# EAGLE design MicrocontrollerBoard_V0.2 (EAGLE 6.4)
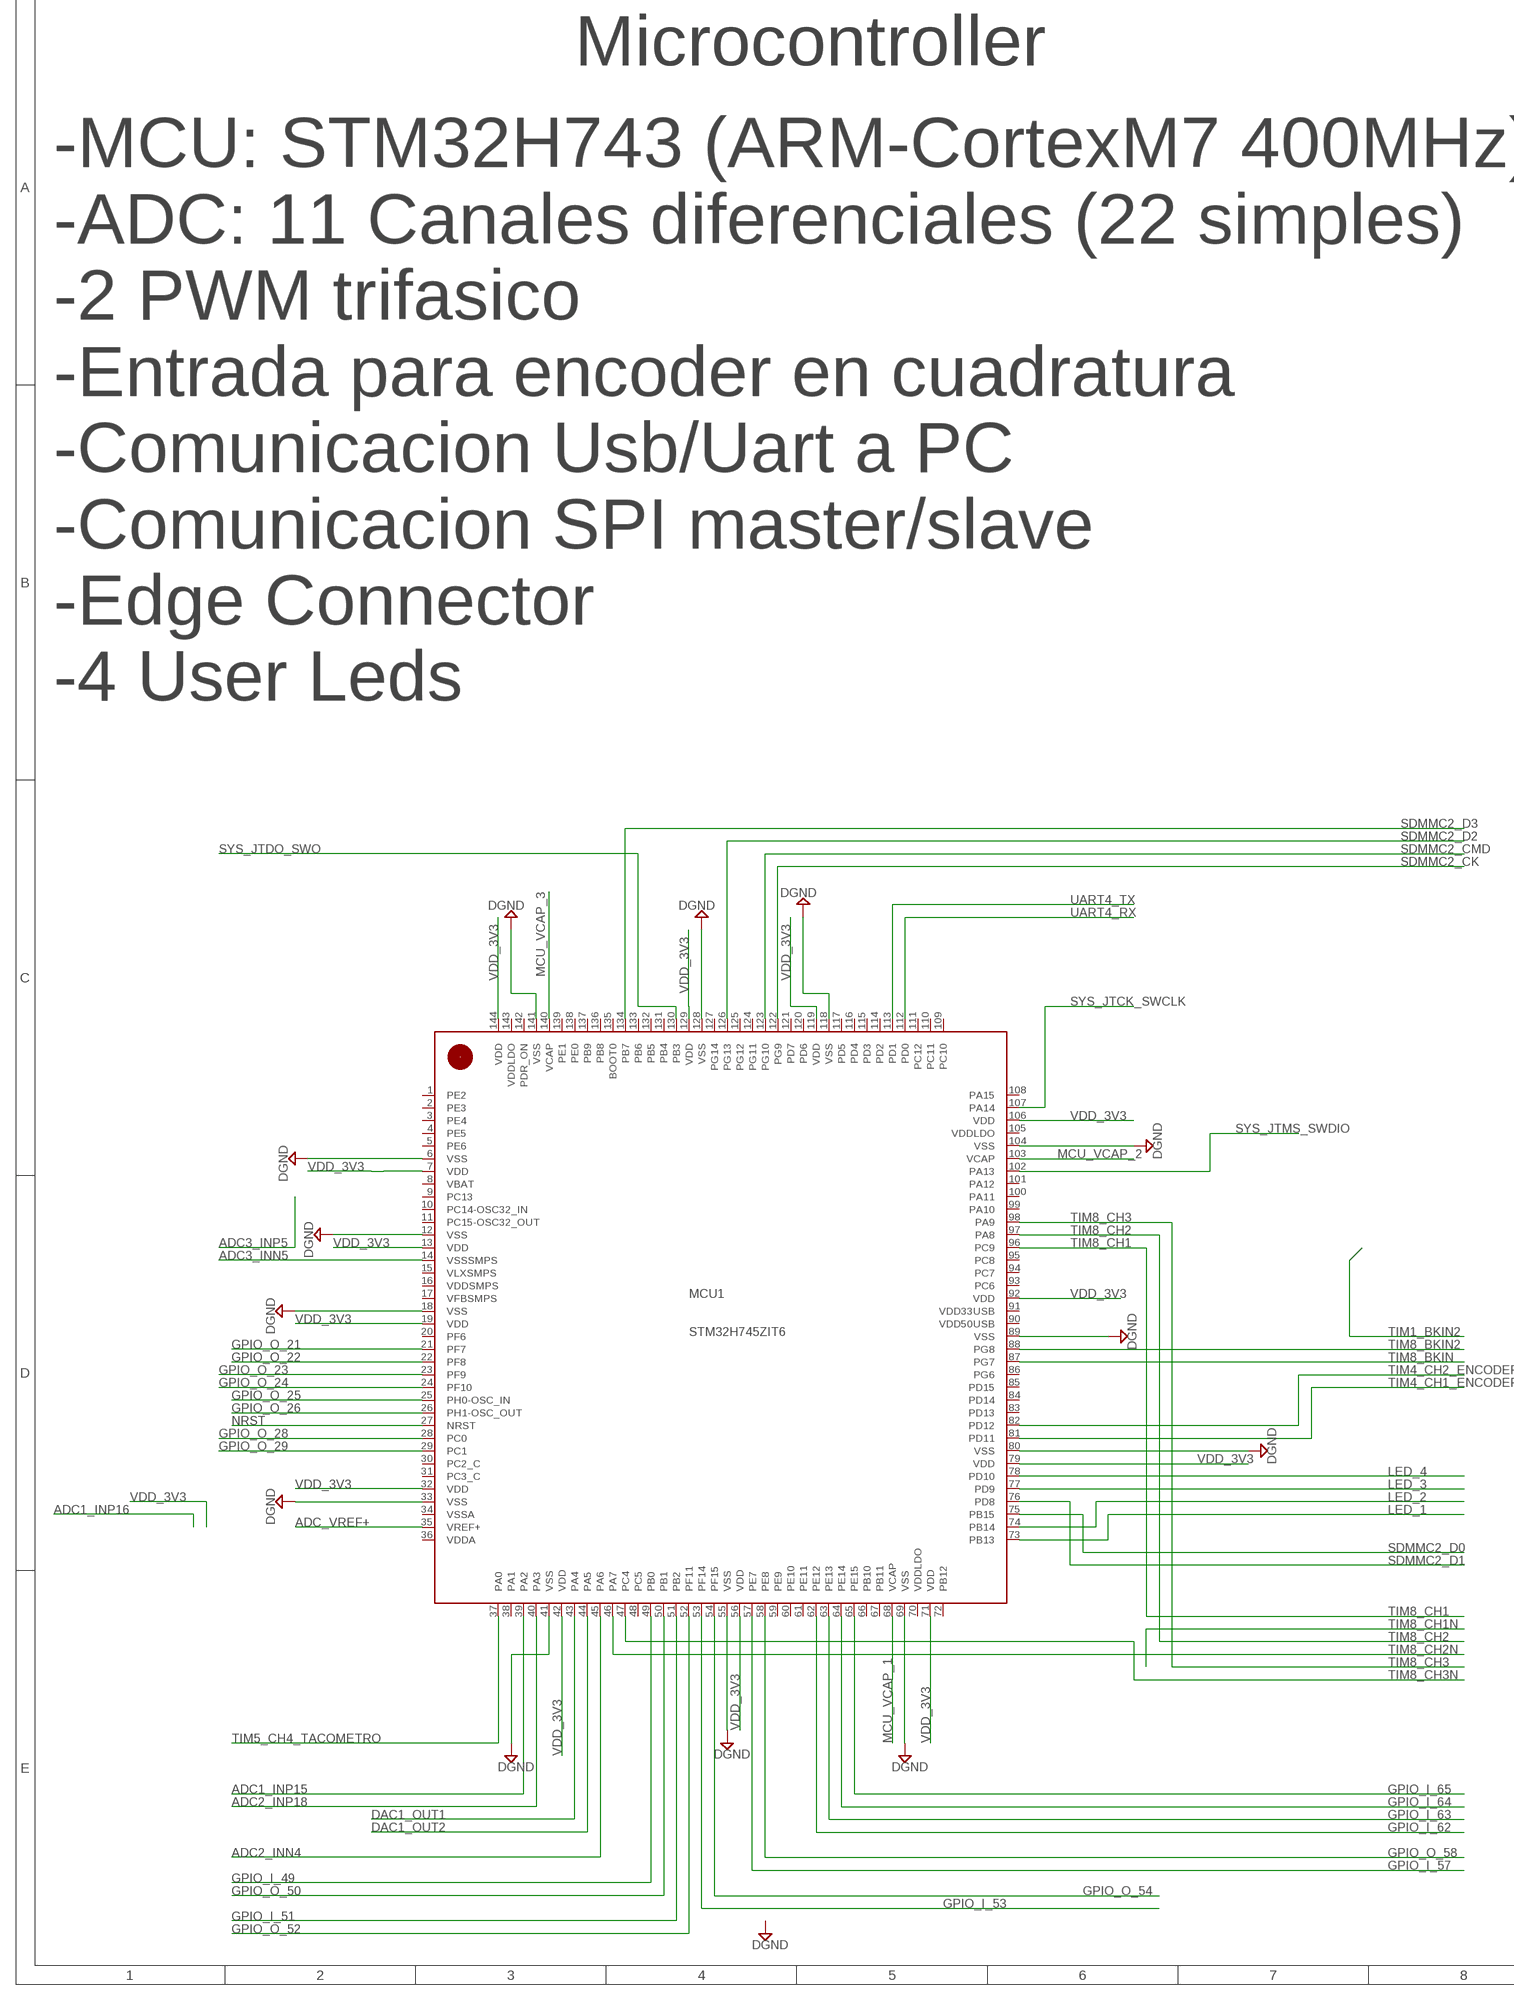
[diagram p0: schematic, sheet 1, part 1 of 2]
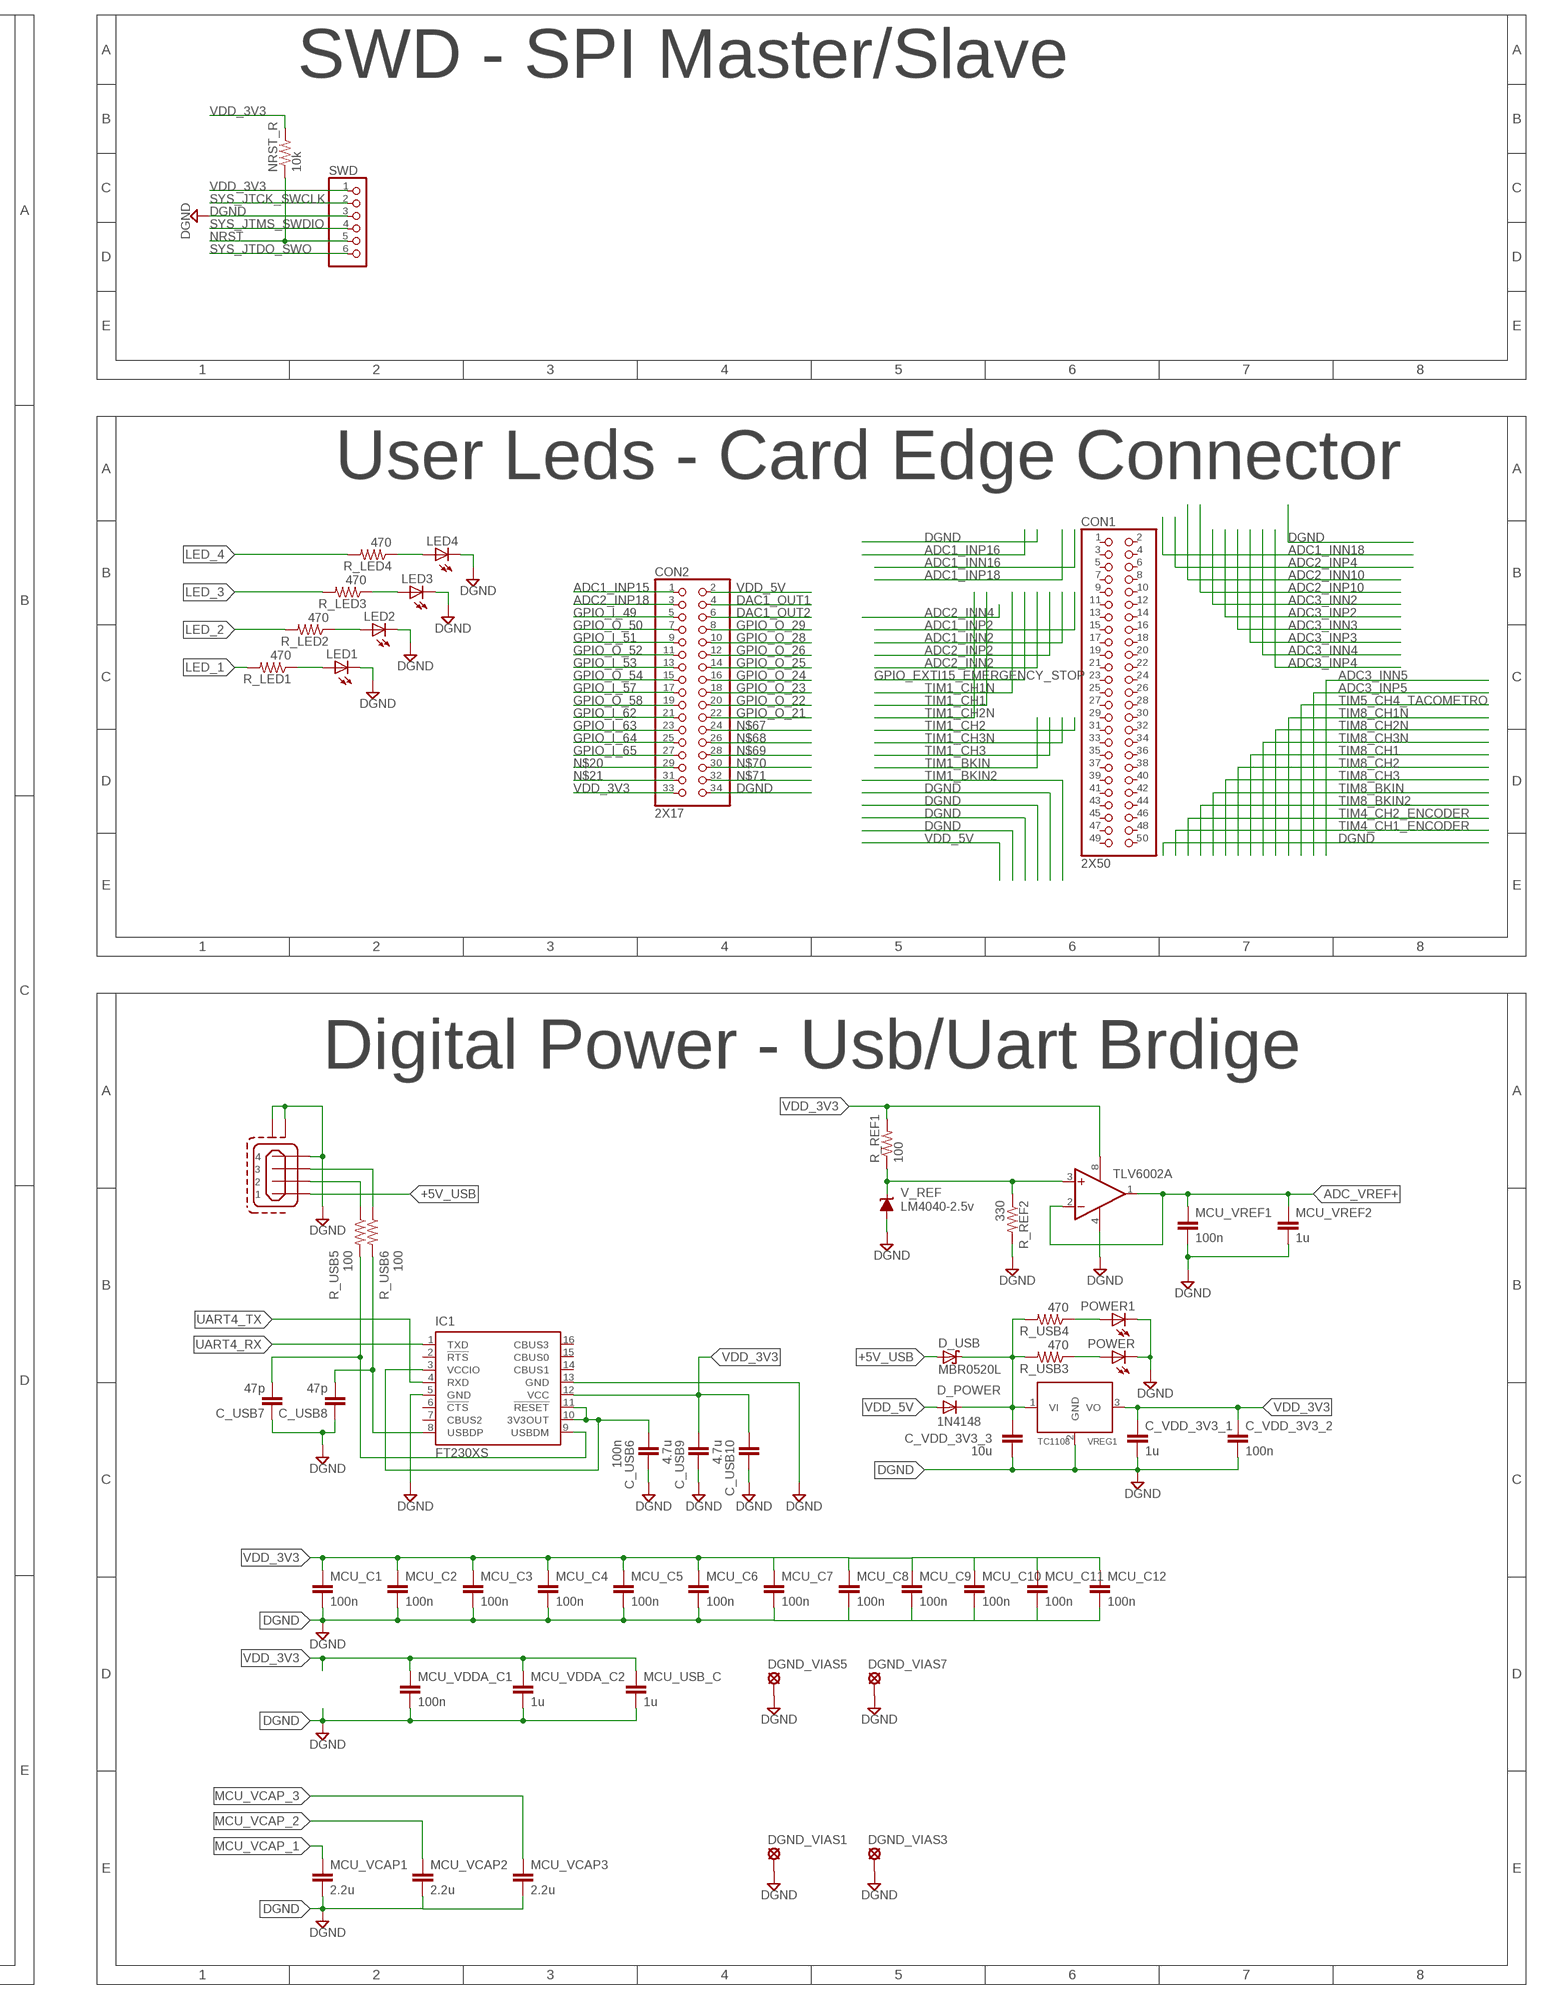
[diagram p1: schematic, sheet 1, part 2 of 2]

## Parts
C_USB6  100n  C-EUC0402  [C0402]
C_USB7  47p  C-EUC0402  [C0402]
C_USB8  47p  C-EUC0402  [C0402]
C_USB9  4.7u  C-EUC0402  [C0402]
C_USB10  4.7u  C-EUC0402  [C0402]
C_VDD_3V3_1  1u  C-EUC0603K  [C0603K]
C_VDD_3V3_2  100n  C-EUC0603K  [C0603K]
C_VDD_3V3_3  10u  C-EUC0603K  [C0603K]
CON1  2X50  [2X25]
CON2  2X17  [2X17]
D_POWER  1N4148  GF1  [SMA-DO214AC]
D_USB  MBR0520L  [SOD-123]
DGND_VIAS1  LSP10  [LSP10]
DGND_VIAS3  LSP10  [LSP10]
DGND_VIAS5  LSP10  [LSP10]
DGND_VIAS7  LSP10  [LSP10]
IC1  FT230XS  [SSOP16]
LED1  LEDCHIPLED_0805  [CHIPLED_0805]
LED2  LEDCHIPLED_0805  [CHIPLED_0805]
LED3  LEDCHIPLED_0805  [CHIPLED_0805]
LED4  LEDCHIPLED_0805  [CHIPLED_0805]
MCU1  STM32H745ZIT6144  [LQFP144]
MCU_C1  100n  C-EUC0402  [C0402]
MCU_C2  100n  C-EUC0402  [C0402]
MCU_C3  100n  C-EUC0402  [C0402]
MCU_C4  100n  C-EUC0402  [C0402]
MCU_C5  100n  C-EUC0402  [C0402]
MCU_C6  100n  C-EUC0402  [C0402]
MCU_C7  100n  C-EUC0402  [C0402]
MCU_C8  100n  C-EUC0402  [C0402]
MCU_C9  100n  C-EUC0402  [C0402]
MCU_C10  100n  C-EUC0402  [C0402]
MCU_C11  100n  C-EUC0402  [C0402]
MCU_C12  100n  C-EUC0402  [C0402]
MCU_USB_C  1u  C-EUC0402  [C0402]
MCU_VCAP1  2.2u  C-EUC0402  [C0402]
MCU_VCAP2  2.2u  C-EUC0402  [C0402]
MCU_VCAP3  2.2u  C-EUC0402  [C0402]
MCU_VDDA_C1  100n  C-EUC0402  [C0402]
MCU_VDDA_C2  1u  C-EUC0402  [C0402]
MCU_VREF1  100n  C-EUC0402  [C0402]
MCU_VREF2  1u  C-EUC0402  [C0402]
NRST_R  10k  R-US_R0402  [R0402]
POWER  LEDCHIPLED_0805  [CHIPLED_0805]
POWER1  LEDCHIPLED_0805  [CHIPLED_0805]
R_LED1  470  R-US_R0402  [R0402]
R_LED2  470  R-US_R0402  [R0402]
R_LED3  470  R-US_R0402  [R0402]
R_LED4  470  R-US_R0402  [R0402]
R_REF1  100  R-US_R0805  [R0805]
R_REF2  330  R-US_R0805  [R0805]
R_USB3  470  R-US_R0402  [R0402]
R_USB4  470  R-US_R0402  [R0402]
R_USB5  100  R-US_R0402  [R0402]
R_USB6  100  R-US_R0402  [R0402]
SWD  PINHD-1X6/90  [1X06/90]
TLV6002  TL082D  [SO08]
V_REF  LM4040-2.5v  LM4041A12DBZ  [DBZ_R-PDSO-G3]
VREG1  TC1108'SOT-223'  [SOT-223]
X2  MINI-USB_SHIELD4P-85-32004-00X  [85-32004-00X]

## Nets
+5V_USB: D_USB.A(IN) X2.1
ADC1_INP15: CON2.1 MCU1.39(PA2)
ADC2_INN4: MCU1.45(PA6)
ADC2_INP18: CON2.3 MCU1.40(PA3)
ADC3_INN5: MCU1.14(VSSSMPS)
ADC_VREF+: MCU1.35(VREF+) MCU_VREF1.1 MCU_VREF2.1 TLV6002.1(A:OUT) TLV6002.2(A:-IN)
DAC1_OUT1: CON2.4 MCU1.43(PA4)
DAC1_OUT2: CON2.6 MCU1.44(PA5)
DGND: C_USB6.1 C_USB7.1 C_USB8.1 C_USB9.1 C_USB10.1 C_VDD_3V3_1.2 C_VDD_3V3_2.2 C_VDD_3V3_3.2 CON2.34 DGND_VIAS1.MP DGND_VIAS3.MP DGND_VIAS5.MP DGND_VIAS7.MP IC1.5(GND) IC1.13(GND) LED1.C LED2.C LED3.C LED4.C MCU1.6(VSS) MCU1.12(VSS) MCU1.18(VSS) MCU1.33(VSS) MCU1.41(VSS) MCU1.55(VSS) MCU1.69(VSS) MCU1.80(VSS) MCU1.89(VSS) MCU1.104(VSS) MCU1.118(VSS) MCU1.128(VSS) MCU1.141(VSS) MCU_C1.2 MCU_C2.2 MCU_C3.2 MCU_C4.2 MCU_C5.2 MCU_C6.2 MCU_C7.2 MCU_C8.2 MCU_C9.2 MCU_C10.2 MCU_C11.2 MCU_C12.2 MCU_USB_C.2 MCU_VCAP1.2 MCU_VCAP2.2 MCU_VCAP3.2 MCU_VDDA_C1.2 MCU_VDDA_C2.2 MCU_VREF1.2 MCU_VREF2.2 POWER1.C POWER.C R_REF2.2 SWD.3 TLV6002.4(P:V-) V_REF.2(A) VREG1.2(GND) X2.4 X2.M1(S1) X2.M2(S2)
GPIO_I_49: CON2.5 MCU1.49(PB0)
GPIO_I_51: CON2.9 MCU1.51(PB2)
GPIO_I_53: CON2.13 MCU1.53(PF14)
GPIO_I_57: CON2.17 MCU1.57(PE7)
GPIO_I_62: CON2.21 MCU1.62(PE12)
GPIO_I_63: CON2.23 MCU1.63(PE13)
GPIO_I_64: CON2.25 MCU1.64(PE14)
GPIO_I_65: CON2.27 MCU1.65(PE15)
GPIO_O_21: CON2.22 MCU1.21(PF7)
GPIO_O_22: CON2.20 MCU1.22(PF8)
GPIO_O_23: CON2.18 MCU1.23(PF9)
GPIO_O_24: CON2.16 MCU1.24(PF10)
GPIO_O_25: CON2.14 MCU1.25(PH0-OSC_IN)
GPIO_O_26: CON2.12 MCU1.26(PH1-OSC_OUT)
GPIO_O_28: CON2.10 MCU1.28(PC0)
GPIO_O_29: CON2.8 MCU1.29(PC1)
GPIO_O_50: CON2.7 MCU1.50(PB1)
GPIO_O_52: CON2.11 MCU1.52(PF11)
GPIO_O_54: CON2.15 MCU1.54(PF15)
GPIO_O_58: CON2.19 MCU1.58(PE8)
LED_1: MCU1.73(PB13) R_LED1.2
LED_2: MCU1.74(PB14) R_LED2.2
LED_3: MCU1.77(PD9) R_LED3.2
LED_4: MCU1.78(PD10) R_LED4.2
MCU_VCAP_1: MCU1.68(VCAP) MCU_VCAP1.1
MCU_VCAP_2: MCU1.103(VCAP) MCU_VCAP2.1
MCU_VCAP_3: MCU1.140(VCAP) MCU_VCAP3.1
N$2: LED4.A R_LED4.1
N$7: POWER1.A R_USB4.1
N$11: LED3.A R_LED3.1
N$12: C_USB6.2 IC1.3(VCCIO) IC1.10(3V3OUT) IC1.11(!RESET)
N$15: C_VDD_3V3_3.1 D_POWER.K(C) D_USB.C(OUT) R_USB3.2 R_USB4.2 VREG1.1(VI)
N$16: C_USB8.2 IC1.8(USBDP) R_USB6.2
N$17: C_USB7.2 IC1.9(USBDM) R_USB5.2
N$20: CON2.29
N$21: CON2.31
N$67: CON2.24
N$68: CON2.26
N$69: CON2.28
N$70: CON2.30
N$71: CON2.32
N$133: R_USB5.1 X2.2
N$134: R_USB6.1 X2.3
N$138: POWER.A R_USB3.1
N$144: R_REF1.1 R_REF2.1 TLV6002.3(A:+IN) V_REF.1(C)
N$147: LED1.A R_LED1.1
N$154: LED2.A R_LED2.1
NRST: MCU1.27(NRST) NRST_R.1 SWD.5
SDMMC2_CK: MCU1.122(PG9)
SDMMC2_CMD: MCU1.123(PG10)
SDMMC2_D0: MCU1.75(PB15)
SDMMC2_D1: MCU1.76(PD8)
SDMMC2_D2: MCU1.126(PG13)
SDMMC2_D3: MCU1.134(PB7)
SYS_JTCK_SWCLK: MCU1.107(PA14) SWD.2
SYS_JTDO_SWO: MCU1.130(PB3) SWD.6
SYS_JTMS_SWDIO: MCU1.102(PA13) SWD.4
TIM4_CH1_ENCODER: MCU1.81(PD11)
TIM4_CH2_ENCODER: MCU1.82(PD12)
TIM5_CH4_TACOMETRO: MCU1.37(PA0)
TIM8_BKIN: MCU1.87(PG7)
TIM8_BKIN2: MCU1.88(PG8)
TIM8_CH1: MCU1.96(PC9)
TIM8_CH2: MCU1.97(PA8)
TIM8_CH2N: MCU1.46(PA7)
TIM8_CH3: MCU1.98(PA9)
TIM8_CH3N: MCU1.47(PC4)
UART4_RX: IC1.1(TXD) MCU1.112(PD0)
UART4_TX: IC1.4(RXD) MCU1.113(PD1)
VDD_3V3: C_USB9.2 C_USB10.2 C_VDD_3V3_1.1 C_VDD_3V3_2.1 CON2.33 IC1.12(VCC) MCU1.7(VDD) MCU1.13(VDD) MCU1.19(VDD) MCU1.32(VDD) MCU1.42(VDD) MCU1.56(VDD) MCU1.71(VDD) MCU1.79(VDD) MCU1.92(VDD) MCU1.106(VDD) MCU1.119(VDD) MCU1.129(VDD) MCU1.144(VDD) MCU_C1.1 MCU_C2.1 MCU_C3.1 MCU_C4.1 MCU_C5.1 MCU_C6.1 MCU_C7.1 MCU_C8.1 MCU_C9.1 MCU_C10.1 MCU_C11.1 MCU_C12.1 MCU_USB_C.1 MCU_VDDA_C1.1 MCU_VDDA_C2.1 NRST_R.2 R_REF1.2 SWD.1 TLV6002.8(P:V+) VREG1.3(VO)
VDD_5V: CON2.2 D_POWER.A
Unconnected: CON1.1 CON1.2 CON1.3 CON1.4 CON1.5 CON1.6 CON1.7 CON1.8 CON1.9 CON1.10 CON1.11 CON1.12 CON1.13 CON1.14 CON1.15 CON1.16 CON1.17 CON1.18 CON1.19 CON1.20 CON1.21 CON1.22 CON1.23 CON1.24 CON1.25 CON1.26 CON1.27 CON1.28 CON1.29 CON1.30 CON1.31 CON1.32 CON1.33 CON1.34 CON1.35 CON1.36 CON1.37 CON1.38 CON1.39 CON1.40 CON1.41 CON1.42 CON1.43 CON1.44 CON1.45 CON1.46 CON1.47 CON1.48 CON1.49 CON1.50 IC1.2(!RTS) IC1.6(!CTS) IC1.7(CBUS2) IC1.14(CBUS1) IC1.15(CBUS0) IC1.16(CBUS3) MCU1.1(PE2) MCU1.2(PE3) MCU1.3(PE4) MCU1.4(PE5) MCU1.5(PE6) MCU1.8(VBAT) MCU1.9(PC13) MCU1.10(PC14-OSC32_IN) MCU1.11(PC15-OSC32_OUT) MCU1.15(VLXSMPS) MCU1.16(VDDSMPS) MCU1.17(VFBSMPS) MCU1.20(PF6) MCU1.30(PC2_C) MCU1.31(PC3_C) MCU1.34(VSSA) MCU1.36(VDDA) MCU1.38(PA1) MCU1.48(PC5) MCU1.59(PE9) MCU1.60(PE10) MCU1.61(PE11) MCU1.66(PB10) MCU1.67(PB11) MCU1.70(VDDLDO) MCU1.72(PB12) MCU1.83(PD13) MCU1.84(PD14) MCU1.85(PD15) MCU1.86(PG6) MCU1.90(VDD50USB) MCU1.91(VDD33USB) MCU1.93(PC6) MCU1.94(PC7) MCU1.95(PC8) MCU1.99(PA10) MCU1.100(PA11) MCU1.101(PA12) MCU1.105(VDDLDO) MCU1.108(PA15) MCU1.109(PC10) MCU1.110(PC11) MCU1.111(PC12) MCU1.114(PD2) MCU1.115(PD3) MCU1.116(PD4) MCU1.117(PD5) MCU1.120(PD6) MCU1.121(PD7) MCU1.124(PG11) MCU1.125(PG12) MCU1.127(PG14) MCU1.131(PB4) MCU1.132(PB5) MCU1.133(PB6) MCU1.135(BOOT0) MCU1.136(PB8) MCU1.137(PB9) MCU1.138(PE0) MCU1.139(PE1) MCU1.142(PDR_ON) MCU1.143(VDDLDO) TLV6002.5(B:+IN) TLV6002.6(B:-IN) TLV6002.7(B:OUT)

## Notes on the sheet
- Microcontroller | SWD - SPI Master/Slave
- User Leds - Card Edge Connector
- -MCU: STM32H743 (ARM-CortexM7 400MHz)
  -ADC: 11 Canales diferenciales (22 simples)
  -2 PWM trifasico
  -Entrada para encoder en cuadratura
  -Comunicacion Usb/Uart a PC
  -Comunicacion SPI master/slave
  -Edge Connector
  -4 User Leds
- Digital Power - Usb/Uart Brdige

## Library data of the parts
C_USB6-C_USB10 C_VDD_3V3_1-C_VDD_3V3_3 MCU_C1-MCU_C12 MCU_USB_C MCU_VCAP1-MCU_VCAP3 MCU_VDDA_C1 MCU_VDDA_C2 MCU_VREF1 MCU_VREF2 = rcl:C-EU: CAPACITOR, European symbol
CON1 = CardEdgePads:2X50
CON2 = CardEdgePads:2X17
D_POWER = diode:GF1: DIODE
D_USB = MBR:MBR0520L: The MBR0520L is a Schottky Rectifier whit Low Forward Voltage.
DGND_VIAS1 DGND_VIAS3 DGND_VIAS5 DGND_VIAS7 = solpad:LSP10: SOLDER PAD drill 1.0 mm, distributor Buerklin, 12H555
IC1 = ftdichip:FT230X: USB to BASIC UART IC Auto generated by make-symbol-device-package-bsdl.ulp Rev. 43 Source: Data sheet <http://www.ftdichip.com/Support/Documents/DataSheets/ICs/DS_FT230X.pdf>
LED1-LED4 POWER POWER1 = led:LED: LED OSRAM: - CHIPLED LG R971, LG N971, LY N971, LG Q971, LY Q971, LO R971, LY R971 LH N974, LH R974 LS Q976, LO Q976, LY Q976 LO Q996 - Hyper CHIPLED LW Q18S LB Q993, LB Q99A, LB R99A - SideLED LS A670, LO A670, LY A670, LG A670, LP A670 LB A673, LV A673, LT A673, LW A673 LH A674 LY A675 LS A676, LA A676, LO A676, LY A676, LW A676 LS A679, LY A679, LG A679 - Hyper Micro SIDELED® LS Y876, LA Y876, LO Y876, LY Y876 LT Y87S - SmartLED LW L88C, LW L88S LB L89C, LB L89S, LG L890 LS L89K, LO L89K, LY L89K LS L896, LA L896, LO L896, LY L896 - TOPLED LS T670, LO T670, LY T670, LG T670, LP T670 LSG T670, LSP T670, LSY T670, LOP T670, LYG T670 LG T671, LOG T671, LSG T671 LB T673, LV T673, LT T673, LW T673 LH T674 LS T676, LA T676, LO T676, LY T676, LB T676, LH T676, LSB T676, LW T676 LB T67C, LV T67C, LT T67C, LS T67K, LO T67K, LY T67K, LW E67C LS E67B, LA E67B, LO E67B, LY E67B, LB E67C, LV E67C, LT E67C LW T67C LS T679, LY T679, LG T679 LS T770, LO T770, LY T770, LG T770, LP T770 LB T773, LV T773, LT T773, LW T773 LH T774 LS E675, LA E675, LY E675, LS T675 LS T776, LA T776, LO T776, LY T776, LB T776 LHGB T686 LT T68C, LB T68C - Hyper Mini TOPLED® LB M676 - Mini TOPLED Santana® LG M470 LS M47K, LO M47K, LY M47K Source: http://www.osram.convergy.de LUXEON: - LUMILED® LXK2-PW12-R00, LXK2-PW12-S00, LXK2-PW14-U00, LXK2-PW14-V00 LXK2-PM12-R00, LXK2-PM12-S00, LXK2-PM14-U00 LXK2-PE12-Q00, LXK2-PE12-R00, LXK2-PE12-S00, LXK2-PE14-T00, LXK2-PE14-U00 LXK2-PB12-K00, LXK2-PB12-L00, LXK2-PB12-M00, LXK2-PB14-N00, LXK2-PB14-P00, LXK2-PB14-Q00 LXK2-PR12-L00, LXK2-PR12-M00, LXK2-PR14-Q00, LXK2-PR14-R00 LXK2-PD12-Q00, LXK2-PD12-R00, LXK2-PD12-S00 LXK2-PH12-R00, LXK2-PH12-S00 LXK2-PL12-P00, LXK2-PL12-Q00, LXK2-PL12-R00 Source: www.luxeon.com KINGBRIGHT: KA-3528ASYC Source: www.kingbright.com
MCU1 = STM32H745ZIT6:STM32H745ZIT6
NRST_R R_LED1-R_LED4 R_REF1 R_REF2 R_USB3-R_USB6 = rcl:R-US_: RESISTOR, American symbol
SWD = pinhead:PINHD-1X6: PIN HEADER
TLV6002 = linear:TL082: OP AMP
V_REF = texas:LM4041: PRECISION MICROPOWER SHUNT VOLTAGE REFERENCE Source: http://focus.ti.com/lit/ds/slcs146e/slcs146e.pdf; MPN: LM4041A12IDBZR; OC_FARNELL: 1407949; OC_NEWARK: 58K5875
VREG1 = TC1108:TC1108
X2 = con-cypressindustries:MINI-USB_SHIELD4P-: MINI USB 4 Pol. Source: www.cypressindustries.com; OC_FARNELL: unknown; OC_NEWARK: unknown

## Board
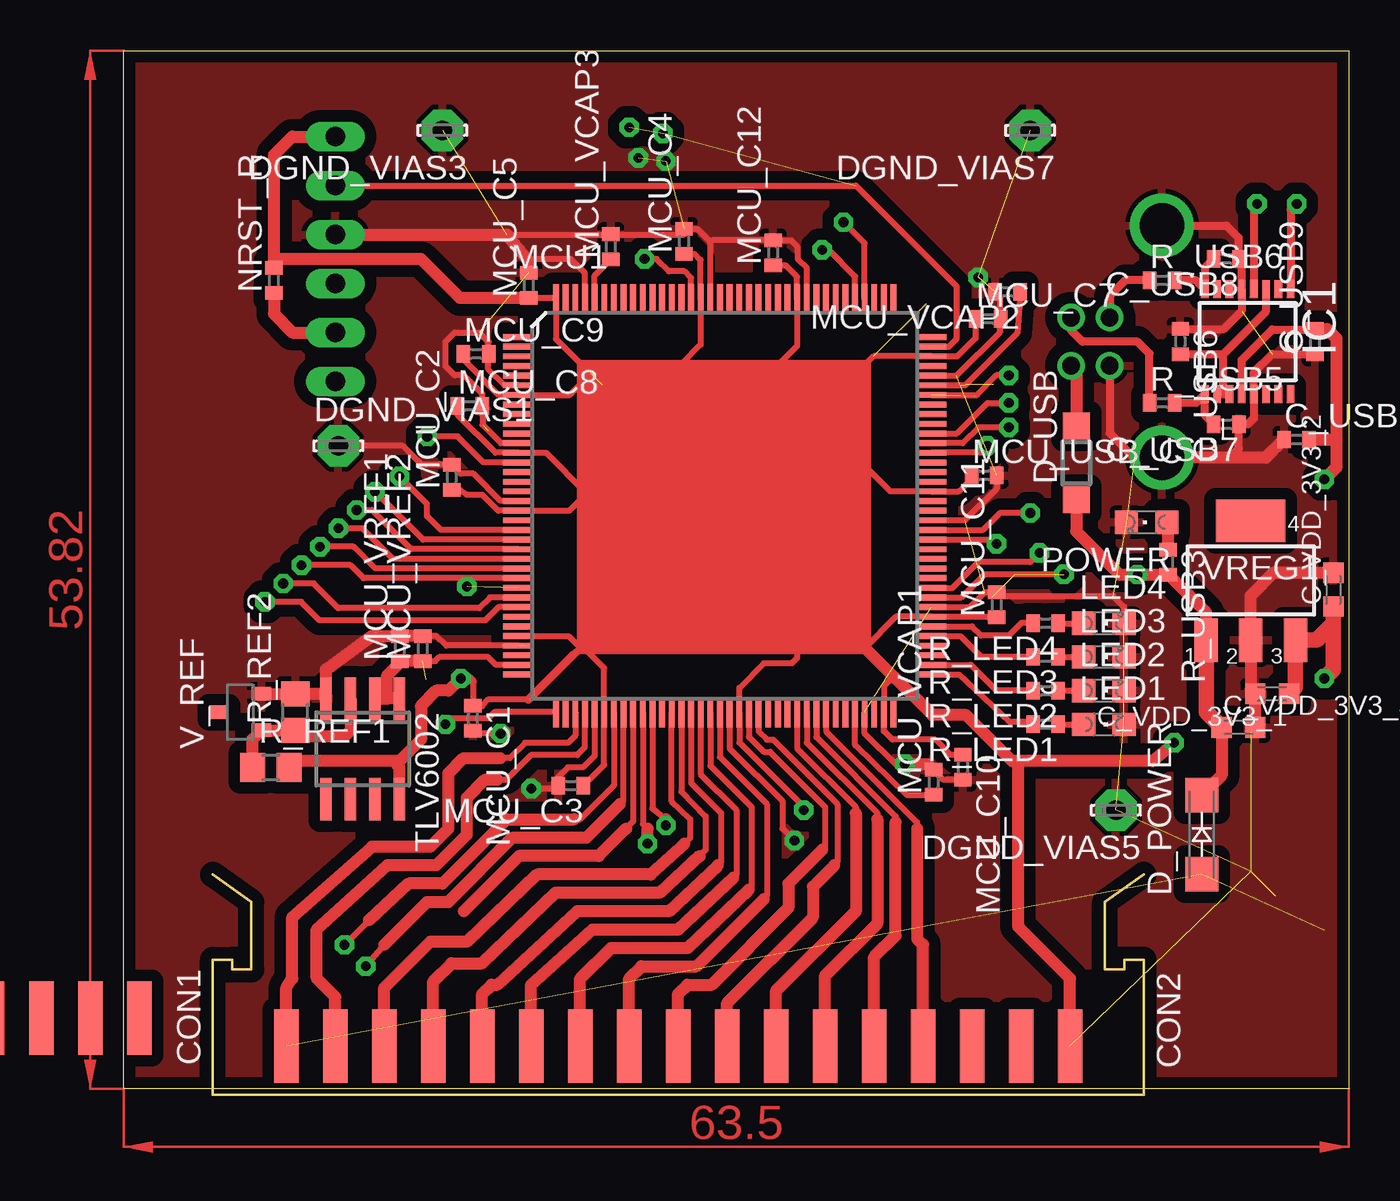
[diagram p2: board, top side]
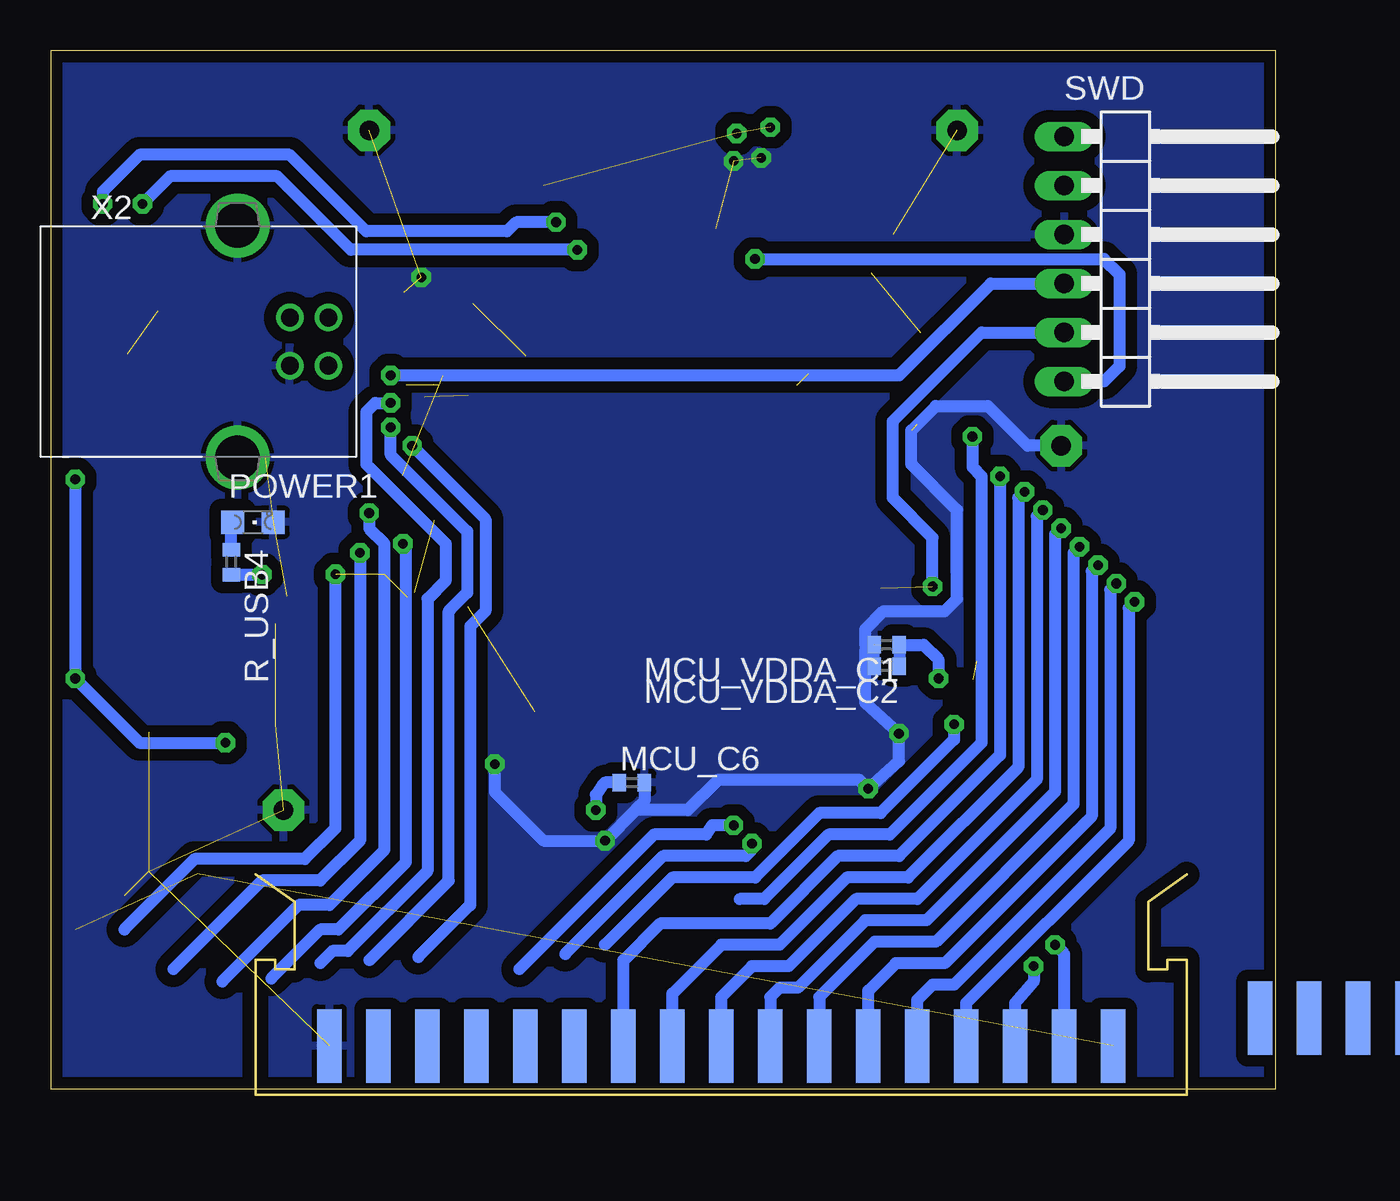
[diagram p3: board, bottom side, seen from below]

Size 63.5 x 53.82 mm. Coordinates in mm from the lower left corner, seen from the top.
Outline: 0,0 0,53.82 63.5,53.82 63.5,0 0,0
Copper layers (1*16): Top 0.035mm / dielectric 1.5mm / Bottom 0.035mm
Design rules "mayer_estandar": minimum track width 5mil, minimum drill 16mil, track to track 5mil, track to pad 5mil, pad to pad 8mil, via to via 8mil, smd to smd 8mil, copper to edge 12mil, drill to drill 8mil, minimum pad ring 10mil, minimum via ring 8mil, stop-mask expansion 4mil, vias tented up to drill 0mil, thermal gap 10mil

### Footprints (pad centres in the part's own frame; a part is rotated, then mirrored left to right if it is on the bottom)
C0402 = smd 0.7 x 0.9: 1 -0.65,0; 2 0.65,0
C0603K = smd 1.05 x 1.08: 1 -0.875,0; 2 0.875,0
2X25 = smd 1.27 x 3.81: 1 -30.48,0; 3 -27.94,0; 5 -25.4,0; 7 -22.86,0; 9 -20.32,0; 11 -17.78,0; 13 -15.24,0; 15 -12.7,0; 17 -10.16,0; 19 -7.62,0; 21 -5.08,0; 23 -2.54,0; 25 0,0; 27 2.54,0; 29 5.08,0; 31 7.62,0; 33 10.16,0; 35 12.7,0; 37 15.24,0; 39 17.78,0; 41 20.32,0; 43 22.86,0; 45 25.4,0; 47 27.94,0; 49 30.48,0 | smd 1.27 x 3.81 bottom: 2 -30.48,0; 4 -27.94,0; 6 -25.4,0; 8 -22.86,0; 10 -20.32,0; 12 -17.78,0; 14 -15.24,0; 16 -12.7,0; 18 -10.16,0; 20 -7.62,0; 22 -5.08,0; 24 -2.54,0; 26 0,0; 28 2.54,0; 30 5.08,0; 32 7.62,0; 34 10.16,0; 36 12.7,0; 38 15.24,0; 40 17.78,0; 42 20.32,0; 44 22.86,0; 46 25.4,0; 48 27.94,0; 50 30.48,0
2X17 = smd 1.27 x 3.81: 1 -20.32,0; 3 -17.78,0; 5 -15.24,0; 7 -12.7,0; 9 -10.16,0; 11 -7.62,0; 13 -5.08,0; 15 -2.54,0; 17 0,0; 19 2.54,0; 21 5.08,0; 23 7.62,0; 25 10.16,0; 27 12.7,0; 29 15.24,0; 31 17.78,0; 33 20.32,0 | smd 1.27 x 3.81 bottom: 2 -20.32,0; 4 -17.78,0; 6 -15.24,0; 8 -12.7,0; 10 -10.16,0; 12 -7.62,0; 14 -5.08,0; 16 -2.54,0; 18 0,0; 20 2.54,0; 22 5.08,0; 24 7.62,0; 26 10.16,0; 28 12.7,0; 30 15.24,0; 32 17.78,0; 34 20.32,0
SMA-DO214AC = smd 1.8 x 1.7: A -2.05,0; K 2.05,0
SOD-123 = smd 1.4 x 1.4: A 1.8,0; C -2,0
LSP10 = drill 1.016 pad 2.159 octagon: MP 0,0
SSOP16 = smd 0.914 x 0.406: 1 -2.718,2.223; 2 -2.718,1.587; 3 -2.718,0.953; 4 -2.718,0.318; 5 -2.718,-0.318; 6 -2.718,-0.953; 7 -2.718,-1.587; 8 -2.718,-2.223; 9 2.718,-2.223; 10 2.718,-1.587; 11 2.718,-0.953; 12 2.718,-0.318; 13 2.718,0.318; 14 2.718,0.953; 15 2.718,1.587; 16 2.718,2.223
CHIPLED_0805 = smd 1.2 x 1.2: A 0,-1.05; C 0,1.05
LQFP144 = smd 1.6 x 0.3: 1 -10.7,8.75; 2 -10.7,8.25; 3 -10.7,7.75; 4 -10.7,7.25; 5 -10.7,6.75; 6 -10.7,6.25; 7 -10.7,5.75; 8 -10.7,5.25; 9 -10.7,4.75; 10 -10.7,4.25; 11 -10.7,3.75; 12 -10.7,3.25; 13 -10.7,2.75; 14 -10.7,2.25; 15 -10.7,1.75; 16 -10.7,1.25; 17 -10.7,0.75; 18 -10.7,0.25; 19 -10.7,-0.25; 20 -10.7,-0.75; 21 -10.7,-1.25; 22 -10.7,-1.75; 23 -10.7,-2.25; 24 -10.7,-2.75; 25 -10.7,-3.25; 26 -10.7,-3.75; 27 -10.7,-4.25; 28 -10.7,-4.75; 29 -10.7,-5.25; 30 -10.7,-5.75; 31 -10.7,-6.25; 32 -10.7,-6.75; 33 -10.7,-7.25; 34 -10.7,-7.75; 35 -10.7,-8.25; 36 -10.7,-8.75; 73 10.7,-8.75; 74 10.7,-8.25; 75 10.7,-7.75; 76 10.7,-7.25; 77 10.7,-6.75; 78 10.7,-6.25; 79 10.7,-5.75; 80 10.7,-5.25; 81 10.7,-4.75; 82 10.7,-4.25; 83 10.7,-3.75; 84 10.7,-3.25; 85 10.7,-2.75; 86 10.7,-2.25; 87 10.7,-1.75; 88 10.7,-1.25; 89 10.7,-0.75; 90 10.7,-0.25; 91 10.7,0.25; 92 10.7,0.75; 93 10.7,1.25; 94 10.7,1.75; 95 10.7,2.25; 96 10.7,2.75; 97 10.7,3.25; 98 10.7,3.75; 99 10.7,4.25; 100 10.7,4.75; 101 10.7,5.25; 102 10.7,5.75; 103 10.7,6.25; 104 10.7,6.75; 105 10.7,7.25; 106 10.7,7.75; 107 10.7,8.25; 108 10.7,8.75 | smd 0.3 x 1.6: 37 -8.75,-10.7; 38 -8.25,-10.7; 39 -7.75,-10.7; 40 -7.25,-10.7; 41 -6.75,-10.7; 42 -6.25,-10.7; 43 -5.75,-10.7; 44 -5.25,-10.7; 45 -4.75,-10.7; 46 -4.25,-10.7; 47 -3.75,-10.7; 48 -3.25,-10.7; 49 -2.75,-10.7; 50 -2.25,-10.7; 51 -1.75,-10.7; 52 -1.25,-10.7; 53 -0.75,-10.7; 54 -0.25,-10.7; 55 0.25,-10.7; 56 0.75,-10.7; 57 1.25,-10.7; 58 1.75,-10.7; 59 2.25,-10.7; 60 2.75,-10.7; 61 3.25,-10.7; 62 3.75,-10.7; 63 4.25,-10.7; 64 4.75,-10.7; 65 5.25,-10.7; 66 5.75,-10.7; 67 6.25,-10.7; 68 6.75,-10.7; 69 7.25,-10.7; 70 7.75,-10.7; 71 8.25,-10.7; 72 8.75,-10.7; 109 8.75,10.7; 110 8.25,10.7; 111 7.75,10.7; 112 7.25,10.7; 113 6.75,10.7; 114 6.25,10.7; 115 5.75,10.7; 116 5.25,10.7; 117 4.75,10.7; 118 4.25,10.7; 119 3.75,10.7; 120 3.25,10.7; 121 2.75,10.7; 122 2.25,10.7; 123 1.75,10.7; 124 1.25,10.7; 125 0.75,10.7; 126 0.25,10.7; 127 -0.25,10.7; 128 -0.75,10.7; 129 -1.25,10.7; 130 -1.75,10.7; 131 -2.25,10.7; 132 -2.75,10.7; 133 -3.25,10.7; 134 -3.75,10.7; 135 -4.25,10.7; 136 -4.75,10.7; 137 -5.25,10.7; 138 -5.75,10.7; 139 -6.25,10.7; 140 -6.75,10.7; 141 -7.25,10.7; 142 -7.75,10.7; 143 -8.25,10.7; 144 -8.75,10.7
R0402 = smd 0.7 x 0.9: 1 -0.65,0; 2 0.65,0
R0805 = smd 1.3 x 1.5: 1 -0.95,0; 2 0.95,0
1X06/90 = drill 1.016 long: 1 -6.35,-3.81; 2 -3.81,-3.81; 3 -1.27,-3.81; 4 1.27,-3.81; 5 3.81,-3.81; 6 6.35,-3.81
SO08 = smd 0.6 x 2.2: 1 -1.905,-2.6; 2 -0.635,-2.6; 3 0.635,-2.6; 4 1.905,-2.6; 5 1.905,2.6; 6 0.635,2.6; 7 -0.635,2.6; 8 -1.905,2.6
DBZ_R-PDSO-G3 = smd 0.7 x 1: 1 -0.95,-1.1; 2 0.95,-1.1; 3 0,1.1
SOT-223 = smd 1.219 x 2.235: 1 -2.311,-3.099; 2 0,-3.099; 3 2.311,-3.099 | smd 3.6 x 2.2: 4 0,3.099
85-32004-00X = drill 0.92 pad 1.27: 1 4.71,-1.25; 2 4.71,1.25; 3 2.71,1.25; 4 2.71,-1.25 | drill 2.3 pad 3: M1 0,6.02; M2 0,-6.02

### Placement (x,y rotation side)
C_USB6  54.77,38.73 270 top
C_USB7  57.15,34.45 180 top
C_USB8  57.15,43.02 180 top
C_USB9  61.75,38.73 90 top
C_USB10  60.8,33.66 0 top
C_VDD_3V3_1  59.53,20.48 180 top
C_VDD_3V3_2  62.71,25.88 90 top
C_VDD_3V3_3  57.78,18.73 0 top
CON1  -29.69,3.65 0 top
CON2  28.73,2.22 0 top
D_POWER  55.88,13.18 90 top
D_USB  49.37,32.54 90 top
DGND_VIAS1  11.11,33.34 0 top
DGND_VIAS3  16.51,49.69 180 top
DGND_VIAS5  51.44,14.45 180 top
DGND_VIAS7  46.99,49.69 180 top
IC1  58.26,38.73 270 top
LED1  50.8,18.89 270 top
LED2  50.8,20.64 270 top
LED3  50.8,22.38 270 top
LED4  50.8,24.13 270 top
MCU1  31.15,30.22 0 top
MCU_C1  18.1,19.21 270 top
MCU_C2  16.99,31.71 90 top
MCU_C3  23.18,15.72 180 top
MCU_C4  29.04,43.94 90 top
MCU_C5  20.99,41.65 90 top
MCU_C6  33.37,15.88 0 bottom
MCU_C7  44.8,39.91 0 top
MCU_C8  17.94,35.4 0 top
MCU_C9  18.26,38.1 0 top
MCU_C10  43.5,16.67 270 top
MCU_C11  45.24,25.08 90 top
MCU_C12  33.66,43.34 90 top
MCU_USB_C  44.6,31.8 0 top
MCU_VCAP1  41.97,15.89 90 top
MCU_VCAP2  45.82,41.31 180 top
MCU_VCAP3  25.24,43.66 90 top
MCU_VDDA_C1  20.16,23.02 180 bottom
MCU_VDDA_C2  20.16,21.91 180 bottom
MCU_VREF1  14.3,22.82 90 top
MCU_VREF2  15.49,22.82 90 top
NRST_R  7.78,41.91 90 top
POWER  53.02,29.37 90 top
POWER1  53.02,29.37 270 bottom
R_LED1  47.78,18.89 180 top
R_LED2  47.78,20.64 180 top
R_LED3  47.78,22.38 180 top
R_LED4  47.78,24.13 180 top
R_REF1  7.62,16.67 0 top
R_REF2  8.89,19.53 90 top
R_USB3  54.13,27.3 270 top
R_USB4  54.13,27.3 270 bottom
R_USB5  53.82,35.56 0 top
R_USB6  53.82,41.91 0 top
SWD  7.14,43.02 270 bottom
TLV6002  12.38,17.62 180 top
V_REF  6.03,19.53 90 top
VREG1  58.42,26.35 0 top
X2  53.82,38.73 0 bottom

### Tracks (layer width: path | path; a pad name or v marks a point on that pad's centre or on a via)
+5V_USB
  Top 0.61: X2.1 49.37,37.22 D_USB.A
ADC1_INP15
  Top 0.305: MCU1.39 23.4,18.32 23.02,17.94 20.8,17.94 20,17.14 19.53,17.14
  Top 0.61: 19.53,17.14 17.62,17.14 16.83,16.35 16.83,13.49 15.88,12.54 12.86,12.54 8.73,8.89 8.73,5.71 8.41,5.24 CON2.1
ADC2_INN4
  Top 0.305: MCU1.45 26.4,13.86 26.04,13.49
  Top 0.61: 17.62,9.21 20.48,12.06 24.61,12.06 26.04,13.49
ADC2_INP18
  Top 0.305: 19.37,16.03 19.84,16.03 21.11,17.3 23.5,17.3 23.9,17.71 MCU1.40
  Top 0.61: 19.37,16.03 18.73,16.03 17.78,15.08 17.78,13.18 16.19,11.59 13.65,11.59 10,8.26 10,5.71 10.95,4.76 CON2.3
ADC3_INN5  (via drill 0.5 pad 1)
  Top 0.305: MCU1.14 18.65,32.47 17.3,33.81 v15.72,33.81
  Bottom 0.61: v15.72,33.81 15.72,32.23 15.24,31.75 15.24,17.94 20,13.18 23.18,13.18 26.51,9.84 27.78,9.84
ADC_VREF+  (1 unrouted)
  Top 0.305: MCU1.35 19.3,21.97 18.89,22.38 16.35,22.38 16.14,22.17 MCU_VREF2.1
  Top 0.61: MCU_VREF2.1 MCU_VREF1.1 14.39,22.17 13.65,21.43 13.65,20.22 | TLV6002.2 13.65,20.22 | TLV6002.1 13.65,20.22
DAC1_OUT1  (via drill 0.5 pad 1)
  Top 0.305: 23.34,13.97 23.65,13.97 25.4,15.72 MCU1.43 | 12.7,8.73 v11.43,7.46
  Top 0.61: 12.7,8.73 14.76,10.64 16.51,10.64 19.84,13.97 23.34,13.97
  Bottom 0.61: CON2.4 10.95,6.99 v11.43,7.46
DAC1_OUT2  (via drill 0.5 pad 1)
  Top 0.305: 25.72,14.76 25.9,14.95 MCU1.44 | 13.49,7.46 v12.54,6.35
  Top 0.61: 13.49,7.46 15.72,9.68 16.83,9.68 20.16,13.02 23.97,13.02 25.72,14.76
  Bottom 0.61: CON2.6 13.49,4.45 12.54,5.56 v12.54,6.35
DGND  (via drill 0.5 pad 1)  (23 unrouted)
  Top 0.305: 15.78,23.34 MCU_VREF2.2 16.22,23.47 16.72,22.97 MCU1.33 | v34.77,12.86 34.13,13.49 34.13,14.92 31.4,17.65 MCU1.55 | MCU_C5.2 20.99,42.74 21.27,43.02 23.18,43.02 23.9,42.3 MCU1.141 | LED4.C 51.85,24.98 51.28,25.56 45.4,25.56 MCU_C11.2 44.62,25.73 43.86,24.97 MCU1.80 | MCU1.18 19.54,30.47 18.12,31.88 17.47,31.88 MCU_C2.2 15.42,32.36 14.45,33.34 DGND_VIAS1.MP | MCU1.12 19.55,33.47 18.59,34.43 MCU_C8.2 18.59,36.02 17.62,36.99 17.14,36.99 16.67,37.47 16.67,38.73 17.14,39.21 18.41,39.21 18.91,38.72 MCU_C9.2 18.89,38.09 18.89,37.31 19.73,36.47 MCU1.6 | MCU1.41 24.4,17.26 23.81,16.67 23.02,16.67 22.53,16.18 MCU_C3.2 22.37,15.56 v21.11,15.56 | MCU1.69 38.4,18.43 40.01,16.83 v40.48,16.83 | MCU_C10.2 42.49,16.02 MCU_VCAP1.2 | MCU1.89 43.6,29.47 45.25,31.12 MCU_USB_C.2 | MCU1.104 43.16,36.97 45.4,39.21 45.4,39.85 | 45.4,39.85 45.4,41.08 MCU_VCAP2.2 | MCU1.118 35.4,42.55 34.92,43.02 34.92,43.66 34.59,43.99 MCU_C12.2 30.5,43.99 30.4,43.89 | MCU1.128 30.4,43.89 | v19.53,18.41 18.26,18.41 MCU_C1.2 | 30.4,43.89 29.71,44.59 MCU_C4.2 29.04,44.29 25.4,44.29 | 19.84,44.29 25.4,44.29 | MCU_C7.2 45.34,39.91 45.4,39.85 | MCU_VCAP3.2 25.39,44.31 25.4,44.29
  Top 0.406: C_USB9.1 61.74,38.1 59.53,38.1 58.58,37.15 IC1.13 58.58,34.77 58.26,34.45 C_USB7.1 57.8,33.19 57.32,32.72 X2.M2 53.8,32.7 52.39,32.7 51.11,33.98 X2.4 | C_USB6.1 54.78,39.37 56.99,39.37 57.94,40.32 IC1.5 57.94,43.02 C_USB8.1 57.78,43.04 57.78,44.13 57.16,44.76 X2.M1
  Top 0.61: MCU_VREF2.2 MCU_VREF1.2 12.83,23.47 10.48,21.75 TLV6002.4 10.22,20.48 R_REF2.2 V_REF.2 | C_VDD_3V3_2.2 59.61,26.75 58.42,25.56 VREG1.2 58.42,20.71 C_VDD_3V3_1.2 C_VDD_3V3_3.2 58.42,18.5 | v40.48,16.83 41.66,16.83 MCU_VCAP1.2 | MCU_C5.2 20.99,42.9 19.84,44.29 SWD.3 | C_USB10.1 59.21,32.72 X2.M2
  Bottom 0.61: MCU_VDDA_C2.2 MCU_VDDA_C1.2 | MCU_VDDA_C1.2 21.27,23.02 21.27,23.81 20.32,24.77 17.14,24.77 16.51,25.4 16.51,30 18.89,32.38 18.89,34.13 17.62,35.4 14.92,35.4 12.86,33.34 DGND_VIAS1.MP | v40.48,16.83 40.48,15.4 37.94,12.86 v34.77,12.86 33.18,14.45 | MCU_VDDA_C1.2 20.95,23.02 21.27,22.7 21.27,20 v19.53,18.41 19.53,16.99 v21.11,15.56 21.59,16.03 28.89,16.03 30.48,14.45 33.18,14.45 | MCU_C6.2 32.72,14.9 33.18,14.45
  other vias: 26.67,48.26 28.1,48.1 44.29,42.07
  pour Top (isolate 0.61): 0,0 63.5,0 63.5,53.82 0,53.82
  pour Bottom (isolate 0.61): 0,0 63.5,0 63.5,53.82 0,53.82
GPIO_I_49
  Top 0.305: 29.05,12.7 29.37,13.02 29.37,13.97 28.4,14.91 MCU1.49
  Top 0.61: 29.05,12.7 27.3,11.11 21.43,11.11 17.78,7.62 15.88,7.62 13.49,5.24 CON2.5
GPIO_I_51
  Top 0.305: 30.8,11.59 30.96,11.75 30.96,14.29 29.4,15.84 MCU1.51
  Top 0.61: CON2.9 18.57,4.92 19.05,5.4 19.37,5.4 23.5,9.21 28.26,9.21 30.8,11.59
GPIO_I_53
  Top 0.305: 32.38,10.32 32.54,10.48 32.54,14.61 30.4,16.75 MCU1.53
  Top 0.61: CON2.13 23.65,5.71 25.24,7.3 29.21,7.3 32.38,10.32
GPIO_I_57
  Top 0.305: MCU1.57 32.4,18.24 33.18,17.46 33.5,17.46 36.35,14.61 36.35,12.54 36.2,12.38
  Top 0.61: 36.2,12.38 34.45,10.64 34.45,9.37 30.48,5.4 29.21,5.4 28.73,4.92 CON2.17
GPIO_I_62
  Top 0.305: 37.94,14.29 37.94,14.61 34.9,17.64 MCU1.62
  Top 0.61: CON2.21 33.81,5.08 37.94,9.21 37.94,14.29
GPIO_I_63
  Top 0.305: 39.05,13.97 39.05,14.29 35.4,17.94 MCU1.63
  Top 0.61: 39.05,13.97 39.05,8.57 36.35,5.87 CON2.23
GPIO_I_64
  Top 0.305: 40.01,13.81 40.01,14.13 35.9,18.23 MCU1.64
  Top 0.61: CON2.25 38.89,6.83 40.01,7.94 40.01,13.81
GPIO_I_65
  Top 0.305: 41.12,13.49 41.12,13.81 36.4,18.53 MCU1.65
  Top 0.61: CON2.27 41.43,7.46 41.12,7.78 41.12,13.49
GPIO_O_21  (via drill 0.5 pad 1)
  Top 0.305: v14.29,31.75 15.72,30.32 15.72,29.69 16.43,28.97 MCU1.21
  Bottom 0.61: v14.29,31.75 14.29,17.3 19.53,12.06 22.7,12.06 26.19,8.57 31.91,8.57 33.81,6.67 CON2.22
GPIO_O_22  (via drill 0.5 pad 1)
  Top 0.305: v13.02,30.96 15.5,28.47 MCU1.22
  Bottom 0.61: v13.02,30.96 13.34,30.64 13.34,16.67 19.05,10.95 22.23,10.95 25.72,7.46 28.73,7.46 31.27,4.92 CON2.20
GPIO_O_23  (via drill 0.5 pad 1)
  Top 0.305: 12.1,29.97 v12.06,30 12.86,30 14.89,27.97 MCU1.23
  Bottom 0.61: v12.06,30 12.38,29.69 12.38,16.03 18.57,9.84 21.75,9.84 25.24,6.35 27.15,6.35 28.73,4.76 CON2.18
GPIO_O_24  (via drill 0.5 pad 1)
  Top 0.305: v11.11,29.05 12.38,29.05 13.96,27.47 MCU1.24
  Bottom 0.61: v11.11,29.05 11.43,28.73 11.43,15.4 18.1,8.73 21.27,8.73 24.77,5.24 25.72,5.24 26.19,4.76 CON2.16
GPIO_O_25  (via drill 0.5 pad 1)
  Top 0.305: v10.16,28.1 11.91,28.1 13.03,26.97 MCU1.25
  Bottom 0.61: v10.16,28.1 10.48,27.78 10.48,14.76 17.62,7.62 20.8,7.62 23.65,4.76 CON2.14
GPIO_O_26  (via drill 0.5 pad 1)
  Top 0.305: v9.21,27.15 11.75,27.15 12.42,26.47 MCU1.26
  Bottom 0.61: v9.21,27.15 9.53,26.83 9.53,14.13 17.14,6.51 19.68,6.51 21.11,5.08 CON2.12
GPIO_O_28  (via drill 0.5 pad 1)
  Top 0.305: v8.26,26.19 9.84,26.19 11.11,24.92 18.41,24.92 18.98,25.47 MCU1.28
  Bottom 0.61: v8.26,26.19 8.57,25.88 8.57,13.49 16.67,5.4 17.78,5.4 18.57,4.6 CON2.10
GPIO_O_29  (via drill 0.5 pad 1)
  Top 0.305: v7.3,25.24 9.19,25.24 10.14,24.29 18.73,24.29 19.41,24.97 MCU1.29
  Bottom 0.61: v7.3,25.24 7.62,24.92 7.62,12.86 16.03,4.45 CON2.8
GPIO_O_50
  Top 0.305: MCU1.50 28.9,15.41 30.16,14.13 30.16,12.38 29.84,12.06
  Top 0.61: 29.84,12.06 27.78,10.16 22.38,10.16 18.57,6.51 16.99,6.51 16.03,5.56 CON2.7
GPIO_O_52
  Top 0.305: 31.59,10.95 31.75,11.11 31.75,14.45 29.9,16.3 MCU1.52
  Top 0.61: CON2.11 21.11,5.4 24.29,8.26 28.73,8.26 31.59,10.95
GPIO_O_54
  Top 0.305: 33.18,9.84 33.34,10 33.34,14.76 30.9,17.2 MCU1.54
  Top 0.61: CON2.15 26.19,5.71 26.83,6.35 29.69,6.35 33.18,9.84
GPIO_O_58
  Top 0.305: MCU1.58 32.9,18.53 33.34,18.1 33.66,18.1 36.99,14.76 36.99,11.75 36.83,11.59
  Top 0.61: 36.83,11.59 35.72,10.48 35.72,8.89 31.27,4.45 CON2.19
LED_1
  Top 0.305: MCU1.73 43.3,21.47 45.88,19.05 46.98,19.05 R_LED1.2
LED_2
  Top 0.305: MCU1.74 43.91,21.97 45.24,20.64 R_LED2.2
LED_3
  Top 0.305: MCU1.77 43.36,23.47 44.45,22.38 R_LED3.2
LED_4
  Top 0.305: R_LED4.2 47.11,24.15 46.54,24.15 45.88,23.5 44.45,23.5 43.97,23.97 MCU1.78
MCU_VCAP_1
  Top 0.305: MCU_VCAP1.1 40.57,15.24 37.94,17.78 37.9,17.82 MCU1.68
MCU_VCAP_2  (3 unrouted)
  Top 0.305: MCU1.103 43.62,36.47 46.31,39.17 MCU_VCAP2.1
MCU_VCAP_3
  Top 0.305: MCU1.140 24.4,42.17 MCU_VCAP3.1
N$2
  Top 0.305: R_LED4.1 LED4.A
N$7
  Bottom 0.61: R_USB4.1 54.13,29.31 POWER1.A
N$11
  Top 0.305: R_LED3.1 LED3.A
N$12
  Top 0.406: IC1.10 IC1.11 56.99,36.34 56.99,38.1 | 56.99,38.1 59.21,40.32 IC1.3 | C_USB6.2 56.98,38.09 56.99,38.1
N$15  (via drill 0.5 pad 1)
  Top 0.61: D_USB.C 49.37,28.89 51.61,26.66 v52.55,26.66 R_USB4.2 56.11,24.68 VREG1.1 | C_VDD_3V3_3.1 56.91,16.26 D_POWER.K
  Top 0.813: C_VDD_3V3_3.1 56.11,19.53 VREG1.1
  Bottom 0.61: R_USB4.2 v52.55,26.66
N$16
  Top 0.406: C_USB8.2 56.04,42.56 IC1.8 55.58,41.91 R_USB6.2
N$17
  Top 0.406: C_USB7.2 56.04,34.91 IC1.9 55.58,35.56 R_USB5.2
N$133
  Top 0.406: R_USB5.1 53.17,38.12 52.55,38.73 49.69,38.73 49.11,39.32 X2.2
N$134
  Top 0.406: R_USB6.1 51.91,41.91 51.12,41.12 51.12,40 X2.3
N$138
  Top 0.61: R_USB3.1 54.13,29.31 POWER.A
N$144
  Top 0.61: TLV6002.3 11.75,18.57 11.43,18.26 9.21,18.26 R_REF2.1 V_REF.1 6.67,18.11 R_REF1.1
N$147
  Top 0.305: R_LED1.1 LED1.A
N$154
  Top 0.305: R_LED2.1 LED2.A
NRST  (via drill 0.5 pad 1)  (1 unrouted)
  Top 0.61: NRST_R.1 7.78,40.16 8.73,39.21 SWD.5
  Bottom 0.61: v17.78,26.04 17.78,28.57 19.84,30.64 19.84,34.61 15.24,39.21 SWD.5
SYS_JTCK_SWCLK  (via drill 0.5 pad 1)  (2 unrouted)
  Top 0.305: SWD.2 37.94,46.83 43.18,41.59 43.18,38.89 42.76,38.47 MCU1.107
  other vias: 26.19,49.85 27.94,49.53
SYS_JTDO_SWO  (via drill 0.5 pad 1)
  Top 0.305: v26.99,43.02 27.62,43.02 28.26,42.39 29.05,42.39 29.4,42.04 MCU1.130
  Bottom 0.61: v26.99,43.02 8.89,43.02 8.1,42.23 8.1,37.47 8.89,36.67 SWD.6
SYS_JTMS_SWDIO  (via drill 0.5 pad 1)  (1 unrouted)
  Top 0.305: v45.88,36.99 45.24,36.99 44.23,35.97 MCU1.102
  Bottom 0.61: v45.88,36.99 19.53,36.99 14.76,41.75 SWD.4
TIM4_CH1_ENCODER  (via drill 0.5 pad 1)  (2 unrouted)
  Top 0.305: MCU1.81 43.41,25.47 44.61,26.67 v48.74,26.67
  Bottom 0.61: 59.69,8.26 56.04,11.91 50.32,11.91 48.74,13.49 v48.74,26.67
TIM4_CH2_ENCODER  (via drill 0.5 pad 1)
  Top 0.305: v47.47,27.78 46.99,27.3 44.29,27.3 42.96,25.97 MCU1.82
  Bottom 0.61: v47.47,27.78 47.47,12.86 49.53,10.79 52.55,10.79 57.15,6.19
TIM5_CH4_TACOMETRO  (via drill 0.5 pad 1)
  Top 0.305: 22.4,19.07 MCU1.37 19.21,19.53 18.89,19.21 16.99,19.21 v16.67,18.89
  Bottom 0.61: 34.77,7.46 31.27,10.95 26.99,10.95 23.65,14.29 20.48,14.29 16.67,18.1 v16.67,18.89
TIM8_BKIN  (via drill 0.5 pad 1)
  Top 0.305: MCU1.87 45.03,28.47 v45.24,28.26
  Bottom 0.61: v45.24,28.26 45.09,28.1 45.09,11.75 48.58,8.26 49.53,8.26 52.07,5.71
TIM8_BKIN2  (via drill 0.5 pad 1)
  Top 0.305: MCU1.88 44.53,28.97 45.4,29.84 v46.99,29.84
  Bottom 0.61: 54.61,5.56 50.64,9.53 49.05,9.53 46.2,12.38 46.2,28.26 46.99,29.05 v46.99,29.84
TIM8_CH1  (via drill 0.5 pad 1)
  Top 0.305: v44.77,33.34 44.4,32.97 MCU1.96
  Bottom 0.61: v44.77,33.34 40.96,29.53 40.96,24.77 41.75,23.97 41.75,9.53 44.45,6.83
TIM8_CH2  (via drill 0.5 pad 1)
  Top 0.305: v45.88,34.29 44.29,34.29 43.47,33.47 MCU1.97
  Bottom 0.61: v45.88,34.29 45.88,32.86 41.91,28.89 41.91,25.72 42.78,24.84 42.86,24.77 42.86,10.79 46.99,6.67
TIM8_CH2N  (via drill 0.5 pad 1)
  Top 0.305: MCU1.46 26.9,13.72 27.15,13.49
  Top 0.61: v27.15,12.7 27.15,13.49
  Bottom 0.61: 36.83,6.99 31.75,12.06 27.46,12.06 27.15,12.38 v27.15,12.7
TIM8_CH3  (via drill 0.5 pad 1)
  Top 0.305: MCU1.98 43.18,33.97 44.77,35.56 v45.88,35.56
  Bottom 0.61: v45.88,35.56 46.67,35.56 47.15,35.08 47.15,32.38 43.02,28.26 43.02,26.35 43.97,25.4 43.97,11.27 48.1,7.14 48.9,7.14 49.53,6.51
TIM8_CH3N  (via drill 0.5 pad 1)
  Top 0.305: MCU1.47 27.4,14.54 28.1,13.97
  Top 0.61: 28.1,13.97 v28.1,13.65
  Bottom 0.61: 39.21,6.19 32.23,13.18 29.53,13.18 29.21,13.65 v28.1,13.65
UART4_RX  (via drill 0.5 pad 1)
  Top 0.305: MCU1.112 38.4,43.83 v37.31,44.93
  Top 0.406: v60.8,45.88 60.48,45.56 IC1.1
  Bottom 0.61: v60.8,45.88 60.8,46.51 58.9,48.42 51.12,48.42 47.15,44.45 39.85,44.45 39.37,44.93 v37.31,44.93
UART4_TX  (via drill 0.5 pad 1)
  Top 0.305: MCU1.113 37.9,42.11 36.51,43.5 v36.2,43.5
  Top 0.406: v58.74,45.88 58.58,45.72 IC1.4
  Bottom 0.61: v36.2,43.5 47.94,43.5 51.75,47.31 57.31,47.31 v58.74,45.88
VDD_3V3  (via drill 0.5 pad 1)  (2 unrouted)
  Top 0.305: 23.88,22.98 23.89,23 | 23.89,23 24.35,23.45 | 24.35,23.45 31.08,30.19 | 33.9,33.01 38.87,37.97 MCU1.106 43.21,37.97 44.15,38.91 MCU_C7.1 | 28.9,32.37 24.8,36.47 22.4,38.87 MCU1.144 22.32,41 MCU_C5.1 | 30.41,30.86 31.08,30.19 | 23.81,24.47 24.35,23.45 | 34.9,26.37 38.41,22.86 40.03,24.47 MCU1.79 44.74,24.47 44.78,24.43 MCU_C11.1 | 34.3,26.97 31.08,30.19 | 38.4,27.05 38.47,26.97 34.3,26.97 | 38.3,32.47 38.27,32.44 | v35.24,14.45 35.22,14.47 35.22,14.63 31.9,17.95 MCU1.56 31.9,20.79 33.18,22.07 34.63,22.07 34.9,22.33 34.9,22.81 34.9,26.37 | 23.4,22.56 23.81,22.97 23.89,22.97 23.89,23 | 33.9,33.01 33.9,37.51 34.9,38.51 MCU1.119 34.9,42.09 34.3,42.69 MCU_C12.1 | 33.33,32.44 31.08,30.19 | 38.27,32.44 33.33,32.44 | 28.9,32.37 28.9,37.57 29.9,38.57 MCU1.129 29.9,42.97 29.58,43.29 MCU_C4.1 | 28.9,32.37 30.41,30.86 | 23.99,30.86 30.41,30.86 | 34.9,26.37 34.3,26.97 | 33.9,33.01 33.33,32.44 | MCU_C2.1 17.41,31.06 17.78,30.8 18.57,30.8 19.4,29.97 MCU1.19 23.1,29.97 23.99,30.86 | MCU_C8.1 17.3,35.39 17.3,34.92 19.26,32.97 MCU1.13 21.88,32.97 23.99,30.86 | MCU_C9.1 17.61,37.8 19.43,35.97 MCU1.7 23.11,35.97 24.21,37.07 | 23.69,22.83 23.04,23.47 MCU1.32 | MCU_C3.1 24.9,16.79 MCU1.42 24.9,21.81 23.79,22.91 | 39.9,21.37 39.4,20.87 MCU1.71 39.4,18.54 39.85,18.1 42.07,18.1 42.85,17.32 MCU_C10.1 | 38.27,32.44 39.73,30.97 MCU1.92 43.28,30.97 43.95,31.64 MCU_USB_C.1 | 20.97,20.18 18.88,20.18 18.57,19.84 17.95,19.84 MCU_C1.1 18.1,21.11
  Top 0.406: 23.88,22.98 23.79,22.91 23.69,22.83 23.3,22.51 20.97,20.18 | IC1.12 57.94,37.78 59.53,39.37 61.74,39.37 C_USB9.2 | 7.94,43.02 7.78,43.18 | v17.46,21.27 17.94,21.27 18.1,21.11
  Top 0.61: TLV6002.8 14.29,16.67 13.97,16.99 | 13.97,16.99 8.89,16.99 R_REF1.2 | C_VDD_3V3_2.1 62.71,24.13 | 38.41,22.86 39.9,21.37 41.91,19.37 43.66,19.37 46.04,16.99 46.35,16.99 | 13.97,16.99 14.29,16.99 15.4,18.1 15.4,19.84 16.19,20.64 16.83,20.64 v17.46,21.27 | NRST_R.2 7.78,43.18 7.78,48.42 8.73,49.37 SWD.1 | MCU_C5.1 17.42,41 15.4,43.02 7.94,43.02 | C_USB9.2 62.37,39.38 62.87,38.89 62.87,33.66 | 62.87,33.66 62.87,32.23 v62.23,31.59 | C_USB10.2 62.87,33.66 | v54.45,17.94 53.34,16.99 46.35,16.99 | CON2.33 49.05,5.71 46.35,8.41 46.35,16.99
  Top 0.813: C_VDD_3V3_1.1 60.73,20.8 VREG1.3 61.83,23.25 62.71,24.13 | C_VDD_3V3_2.1 62.71,21.75 v62.23,21.27
  Bottom 0.61: MCU_VDDA_C2.1 MCU_VDDA_C1.1 18.26,23.02 17.46,22.23 v17.46,21.27 | v35.24,14.45 35.24,15.24 34.87,15.77 34.77,15.88 MCU_C6.1 | v54.45,17.94 58.9,17.94 v62.23,21.27 v62.23,31.59
VDD_5V  (2 unrouted)
(copper drawn outside any net)
  shapes: Top area x3